# Altium schematic sheet MCU.SchDoc
size A; SheetNumber: 2; SheetTotal: 7
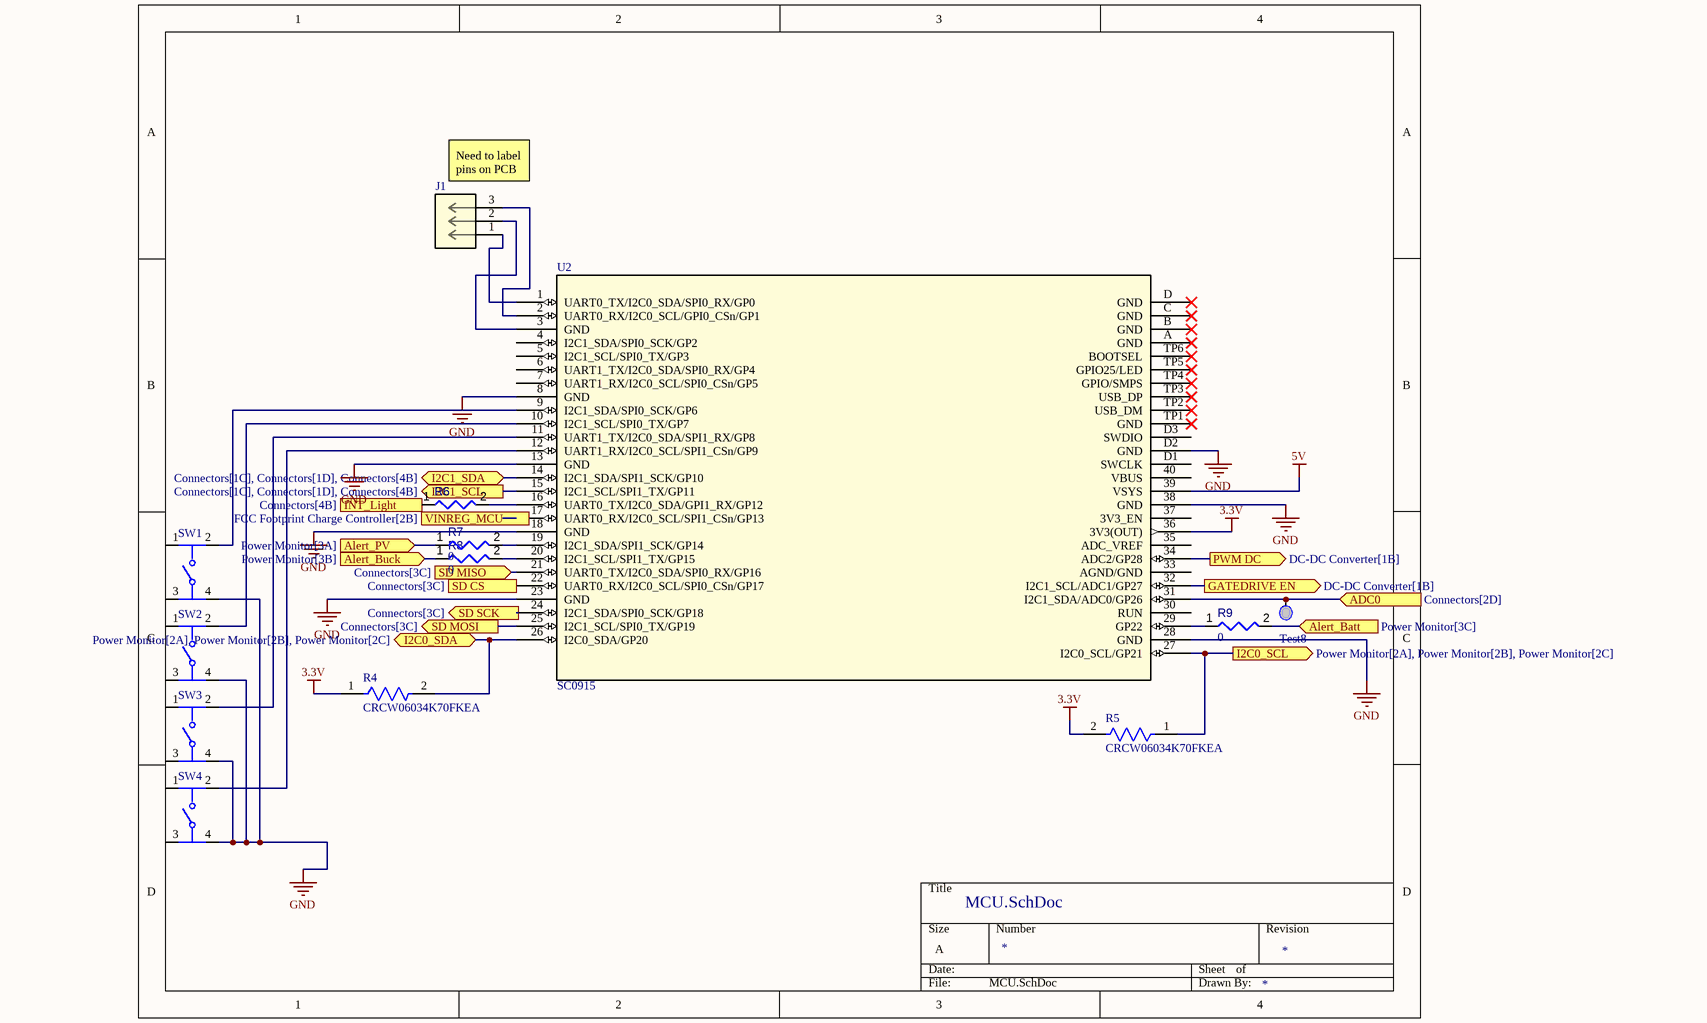
[diagram p0: MCU.SchDoc]

## Parts
J1  (no value)  [CONN_BM03B-SRSS-TBLFSN_JST]
R4  CRCW06034K70FKEA  [FP-CRCW0603-e3-IPC_A]
R5  CRCW06034K70FKEA  [FP-CRCW0603-e3-IPC_A]
R6  value 0  [RESC0603(1608)_L]  (hidden comment: 0R3J)
R7  value 0  [RESC0603(1608)_L]  (hidden comment: 0R3J)
R8  value 0  [RESC0603(1608)_L]  (hidden comment: 0R3J)
R9  value 0  [RESC0603(1608)_L]  (hidden comment: 0R3J)
SW1  (no value)  [FP-PTS645SM43SMTR92LFS-MFG]
SW2  (no value)  [FP-PTS645SM43SMTR92LFS-MFG]
SW3  (no value)  [FP-PTS645SM43SMTR92LFS-MFG]
SW4  (no value)  [FP-PTS645SM43SMTR92LFS-MFG]
Test8  TestPoint  [Test_IN]  (value not drawn)  (no BOM)
U2  SC0915  [SC0915_RPI]

## Ports
ADC0 (in, see Connectors[2D]), Alert_Batt (in, see Power Monitor[3C]), Alert_Buck (in, see Power Monitor[3B]), Alert_PV (in, see Power Monitor[3A]), GATEDRIVE EN (out, see DC-DC Converter[1B]), I2C0_SCL (out, see Power Monitor[2A], Power Monitor[2B], Power Monitor[2C]), I2C0_SDA (bidir, see Power Monitor[2A], Power Monitor[2B], Power Monitor[2C]), I2C1_SCL (out, see Connectors[1C], Connectors[1D], Connectors[4B]), I2C1_SDA (bidir, see Connectors[1C], Connectors[1D], Connectors[4B]), INT_Light (in, see Connectors[4B]), PWM DC (out, see DC-DC Converter[1B]), SD CS (out, see Connectors[3C]), SD MISO (in, see Connectors[3C]), SD MOSI (out, see Connectors[3C]), SD SCK (out, see Connectors[3C]), VINREG_MCU (out, see FCC Footprint Charge Controller[2B])

## Nets
3.3V: R4.1 R5.2 U2.36(3V3(OUT))
5V: U2.39(VSYS)
GND: SW1.4 SW2.4 SW3.4 SW4.4 U2.8(GND) U2.13(GND) U2.18(GND) U2.23(GND) U2.28(GND) U2.38(GND) U2.D2(GND)
ADC0: Test8.IN U2.31(I2C1_SDA/ADC0/GP26) ; port ADC0
Alert_Batt: R9.2 ; port Alert_Batt
Alert_Buck: R8.1 ; port Alert_Buck
Alert_PV: R7.1 ; port Alert_PV
GATEDRIVE EN: U2.32(I2C1_SCL/ADC1/GP27) ; port GATEDRIVE EN
I2C0_SCL: R5.1 U2.27(I2C0_SCL/GP21) ; port I2C0_SCL
I2C0_SDA: R4.2 U2.26(I2C0_SDA/GP20) ; port I2C0_SDA
I2C1_SCL: U2.15(I2C1_SCL/SPI1_TX/GP11) ; port I2C1_SCL
I2C1_SDA: U2.14(I2C1_SDA/SPI1_SCK/GP10) ; port I2C1_SDA
INT_Light: R6.1 ; port INT_Light
PWM DC: U2.34(ADC2/GP28) ; port PWM DC
SD CS: U2.22(UART0_RX/I2C0_SCL/SPI0_CSn/GP17) ; port SD CS
SD MISO: U2.21(UART0_TX/I2C0_SDA/SPI0_RX/GP16) ; port SD MISO
SD MOSI: U2.25(I2C1_SCL/SPI0_TX/GP19) ; port SD MOSI
SD SCK: U2.24(I2C1_SDA/SPI0_SCK/GP18) ; port SD SCK
NetJ1_1: J1.1 U2.1(UART0_TX/I2C0_SDA/SPI0_RX/GP0)
NetJ1_2: J1.2 U2.3(GND)
NetJ1_3: J1.3 U2.2(UART0_RX/I2C0_SCL/GPI0_CSn/GP1)
NetR6_2: R6.2 U2.16(UART0_TX/I2C0_SDA/GPI1_RX/GP12)
NetR7_2: R7.2 U2.19(I2C1_SDA/SPI1_SCK/GP14)
NetR8_2: R8.2 U2.20(I2C1_SCL/SPI1_TX/GP15)
NetR9_1: R9.1 U2.29(GP22)
NetSW1_2: SW1.2 U2.9(I2C1_SDA/SPI0_SCK/GP6)
NetSW2_2: SW2.2 U2.10(I2C1_SCL/SPI0_TX/GP7)
NetSW3_2: SW3.2 U2.11(UART1_TX/I2C0_SDA/SPI1_RX/GP8)
NetSW4_2: SW4.2 U2.12(UART1_RX/I2C0_SCL/SPI1_CSn/GP9)

Not connected (* = marked no-connect by the designer): SW1 1 3; SW2 1 3; SW3 1 3; SW4 1 3; U2 4(I2C1_SDA/SPI0_SCK/GP2) 5(I2C1_SCL/SPI0_TX/GP3) 6(UART1_TX/I2C0_SDA/SPI0_RX/GP4) 7(UART1_RX/I2C0_SCL/SPI0_CSn/GP5) 17(UART0_RX/I2C0_SCL/SPI1_CSn/GP13) 30(RUN) 33(AGND/GND) 35(ADC_VREF) 37(3V3_EN) 40(VBUS) A(GND)* B(GND)* C(GND)* D(GND)* D1(SWCLK) D3(SWDIO) TP1(GND)* TP2(USB_DM)* TP3(USB_DP)* TP4(GPIO/SMPS)* TP5(GPIO25/LED)* TP6(BOOTSEL)*

## Notes on the sheet
- (near J1) Need to label pins on PCB

## Library data of the parts
J1 = BM03B-SRSS-TBLFSN: No Description Available; Mfr_Name: JST; RefDes: RefDes; Type: Type
R4 R5 = CMP-1666-00019-3: RES Thick Film, 4.7kΩ, 1%, 0.1W, 100ppm/°C, 0603; Resistance: 4.7kR; Voltage Rating: 75V; Power Rating: 100mW; Case Code (Metric): 1608; Military Standard: Not; Packaging: Tape and Reel; Termination: SMD/SMT; Temperature Coefficient: 100ppm/°C; Lead Free: Lead Free; Length: 1.55mm; Width: 0.85mm; Height: 0.45mm; Depth: 0.85mm; Weight: 7.1E-05oz; Case Code (Imperial): 0603; Contact Plating: Tin; Case/Package: 0603; Max Operating Temperature: 155°C; Mount: Surface Mount; Tolerance: 1%; Min Operating Temperature: -55°C; Package Quantity: 5000; Voltage Rating (DC): 75V; Composition: Thick Film
R6-R9 = CMP-009-00063-2: Jumper 0603 (1608 Metric); Case/Package: 0603; Mounting Technology: SMT; Pins: 2
SW1-SW4 = CMP-2000-05160-2: SWITCH TACTILE SPST-NO 0.05A 12V; Contact Resistance: 100mR; Throw Configuration: SPST; Illumination Type: Non-Illuminated; Mechanical Life: 100000Cycles; Current Rating: 50mA; Switch Function: Off-Mom; Actuator Length: 0.85mm; Actuator Material: Nylon; Actuator Type: Standard; Operating Force: 160gf; Min Operating Temperature: -20°C; REACH SVHC: No SVHC; Termination: Gull Wing; Case/Package: SMD/SMT; Packaging: Tape and Reel; Mount: Surface Mount; Voltage Rating (DC): 12V; Orientation: Straight; Lead Free: Lead Free; Contact Material: Silver; Color: Black; Max Current Rating: 50mA; Contact Plating: Silver; Depth: 9mm; Package Quantity: 1; Max Voltage Rating (DC): 12V; Length: 6mm; Max Operating Temperature: 60°C
U2 = SC0915: No Description Available; Mfr_Name: Raspberry Pi; RefDes: RefDes; Type: Type